# EAGLE schematic template_atmega328p (EAGLE 9.6.2)

## Sheet 1 of 2
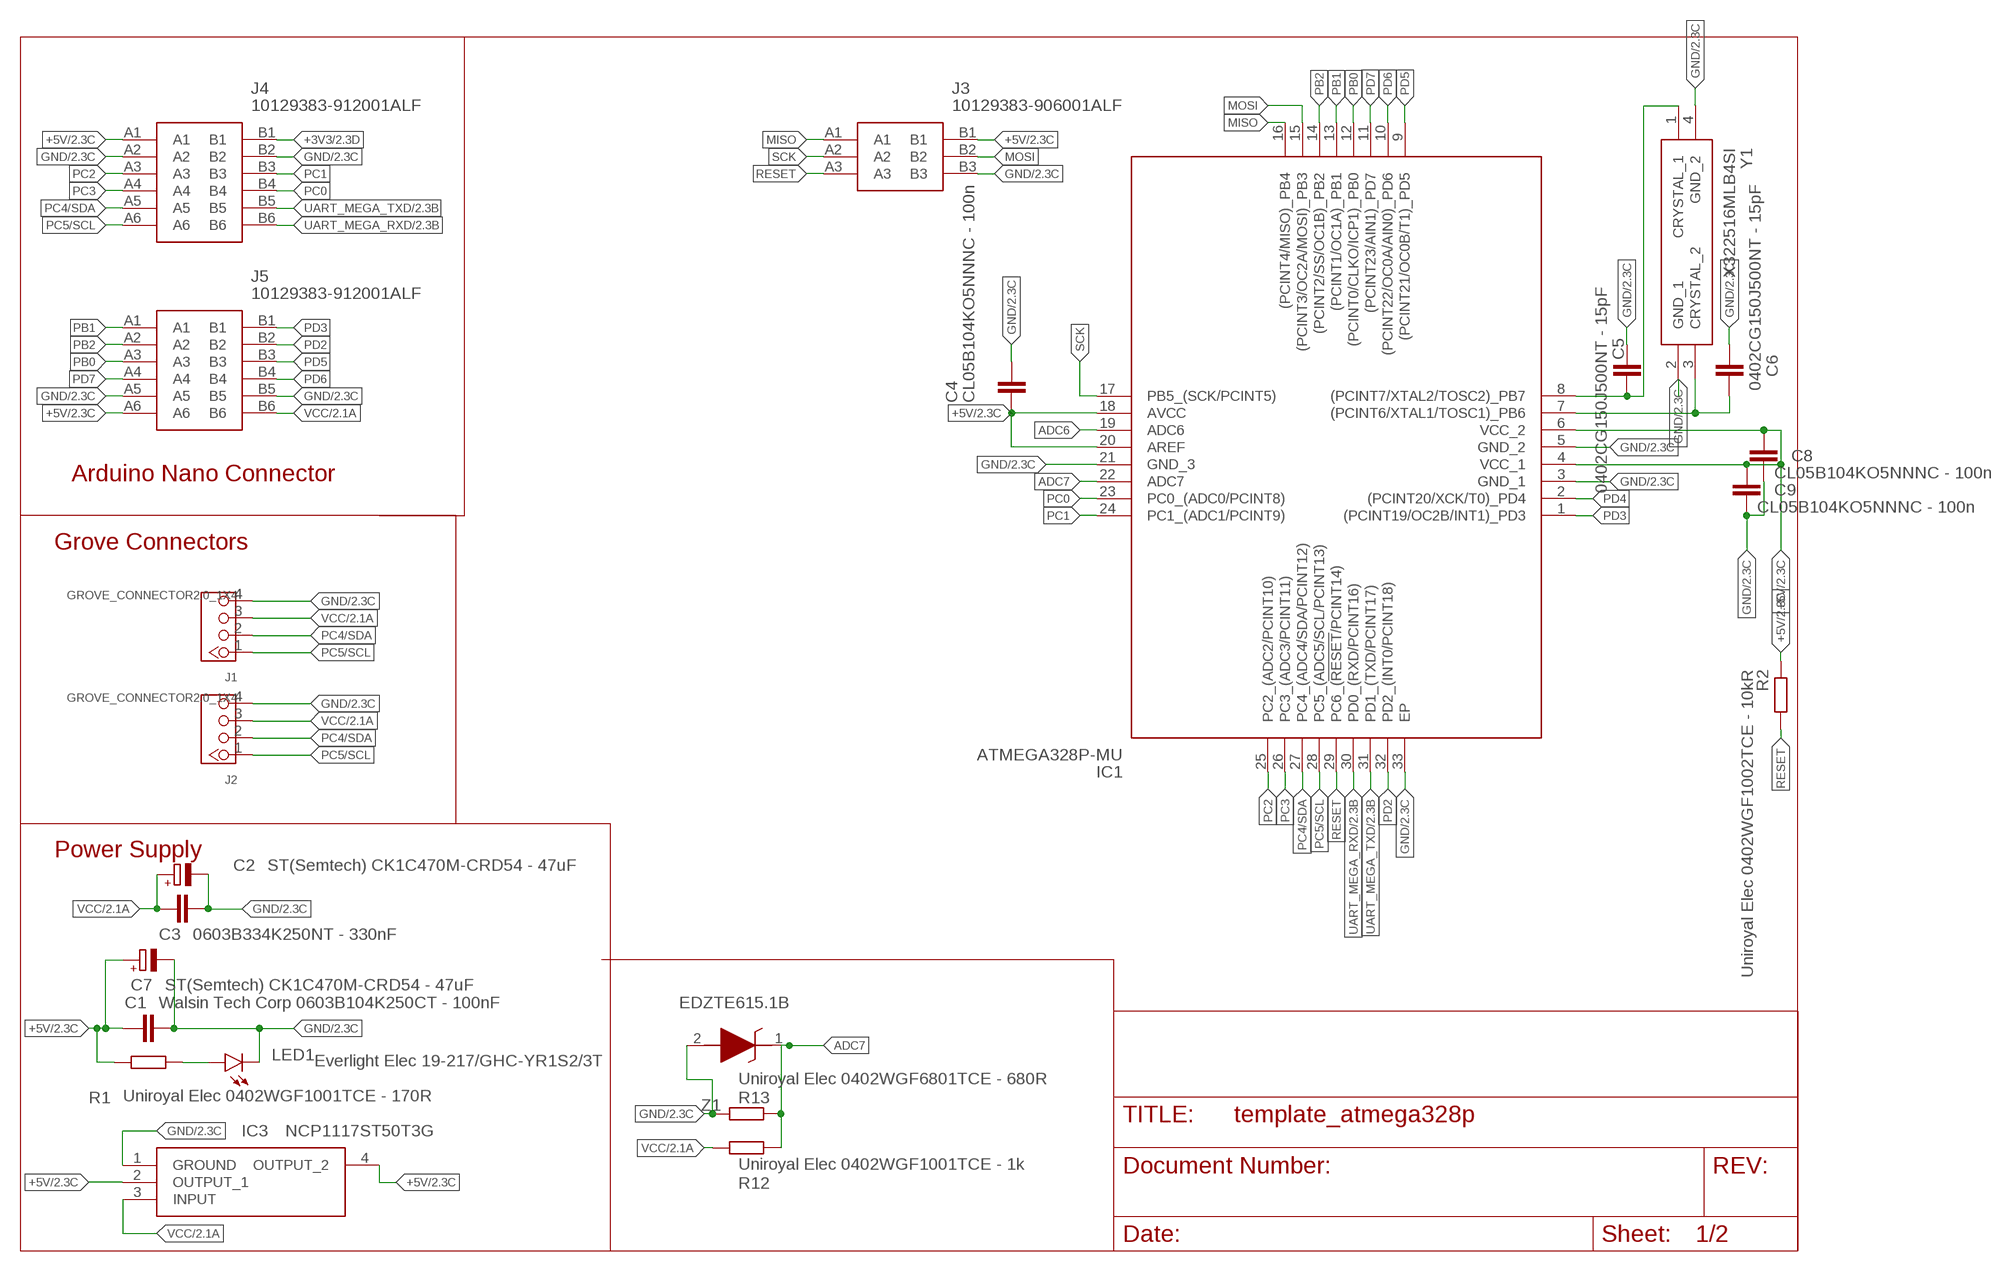
[diagram p0: schematic, sheet 1]

### Parts
C1  Walsin Tech Corp 0603B104K250CT - 100nF  C-EUC0603  [C0603]
C2  ST(Semtech) CK1C470M-CRD54 - 47uF  CPOL-EUC  [PANASONIC_C]
C3  0603B334K250NT - 330nF  C-EUC0603  [C0603]
C4  CL05B104KO5NNNC - 100n  C-EUC0402  [C0402]
C5  0402CG150J500NT - 15pF  C-EUC0402  [C0402]
C6  0402CG150J500NT - 15pF  C-EUC0402  [C0402]
C7  ST(Semtech) CK1C470M-CRD54 - 47uF  CPOL-EUC  [PANASONIC_C]
C8  CL05B104KO5NNNC - 100n  C-EUC0402  [C0402]
C9  CL05B104KO5NNNC - 100n  C-EUC0402  [C0402]
IC1  ATMEGA328P-MU  [QFN50P500X500X100-33N]
IC3  NCP1117ST50T3G  [SOT230P700X180-4N@1]
J1  GROVE_CONNECTOR2.0_1X4  [2.0_1X4_STRAIGHT]
J2  GROVE_CONNECTOR2.0_1X4  [2.0_1X4_STRAIGHT]
J3  10129383-906001ALF  [10129383906001ALF]
J4  10129383-912001ALF  [10129383912001ALF]
J5  10129383-912001ALF  [10129383912001ALF]
LED1  Everlight Elec 19-217/GHC-YR1S2/3T  LEDCHIPLED_0603  [CHIPLED_0603]
R1  Uniroyal Elec 0402WGF1001TCE - 170R  R-EU_R0402  [R0402]
R2  Uniroyal Elec 0402WGF1002TCE - 10kR  R-EU_R0402  [R0402]
R12  Uniroyal Elec 0402WGF1001TCE - 1k  R-EU_R0402  [R0402]
R13  Uniroyal Elec 0402WGF6801TCE - 680R  R-EU_R0402  [R0402]
Y1  X322516MLB4SI  [X322516MLB4SI]
Z1  EDZTE615.1B  [EMD2]

### Nets
+3V3: J4.B1 ; also sheet 2
+5V: C1.1 C4.1 C7.+ C8.2 C9.2 IC1.4(VCC_1) IC1.6(VCC_2) IC1.18(AVCC) IC1.20(AREF) IC3.2(OUTPUT_1) IC3.4(OUTPUT_2) J3.B1 J4.A1 J5.A6 R1.2 R2.2 ; also sheet 2
ADC6: IC1.19(ADC6)
ADC7: IC1.22(ADC7) R12.1 R13.2 Z1.1(K)
GND: C1.2 C2.- C3.1 C4.2 C5.1 C6.1 C7.- C8.1 C9.1 IC1.3(GND_1) IC1.5(GND_2) IC1.21(GND_3) IC1.33(EP) IC3.1(GROUND) J1.4 J2.4 J3.B3 J4.A2 J4.B2 J5.A5 J5.B5 LED1.C R13.1 Y1.2(GND_1) Y1.4(GND_2) Z1.2(A) ; also sheet 2
MISO: IC1.16((PCINT4/MISO)_PB4) J3.A1
MOSI: IC1.15((PCINT3/OC2A/MOSI)_PB3) J3.B2
N$1: LED1.A R1.1
N$2: C5.2 IC1.8((PCINT7/XTAL2/TOSC2)_PB7) Y1.1(CRYSTAL_1)
N$3: C6.2 IC1.7((PCINT6/XTAL1/TOSC1)_PB6) Y1.3(CRYSTAL_2)
PB0: IC1.12((PCINT0/CLKO/ICP1)_PB0) J5.A3
PB1: IC1.13((PCINT1/OC1A)_PB1) J5.A1
PB2: IC1.14((PCINT2/SS/OC1B)_PB2) J5.A2
PC0: IC1.23(PC0_(ADC0/PCINT8)) J4.B4
PC1: IC1.24(PC1_(ADC1/PCINT9)) J4.B3
PC2: IC1.25(PC2_(ADC2/PCINT10)) J4.A3
PC3: IC1.26(PC3_(ADC3/PCINT11)) J4.A4
PC4/SDA: IC1.27(PC4_(ADC4/SDA/PCINT12)) J1.2 J2.2 J4.A5
PC5/SCL: IC1.28(PC5_(ADC5/SCL/PCINT13)) J1.1 J2.1 J4.A6
PD2: IC1.32(PD2_(INT0/PCINT18)) J5.B2
PD3: IC1.1((PCINT19/OC2B/INT1)_PD3) J5.B1
PD4: IC1.2((PCINT20/XCK/T0)_PD4)
PD5: IC1.9((PCINT21/OC0B/T1)_PD5) J5.B3
PD6: IC1.10((PCINT22/OC0A/AIN0)_PD6) J5.B4
PD7: IC1.11((PCINT23/AIN1)_PD7) J5.A4
RESET: IC1.29(PC6_(!RESET!/PCINT14)) J3.A3 R2.1
SCK: IC1.17(PB5_(SCK/PCINT5)) J3.A2
UART_MEGA_RXD: IC1.30(PD0_(RXD/PCINT16)) J4.B6 ; also sheet 2
UART_MEGA_TXD: IC1.31(PD1_(TXD/PCINT17)) J4.B5 ; also sheet 2
VCC: C2.+ C3.2 IC3.3(INPUT) J1.3 J2.3 J5.B6 R12.2 ; also sheet 2

### Notes on the sheet
- Arduino Nano Connector
- Grove Connectors
- Power Supply

## Sheet 2 of 2
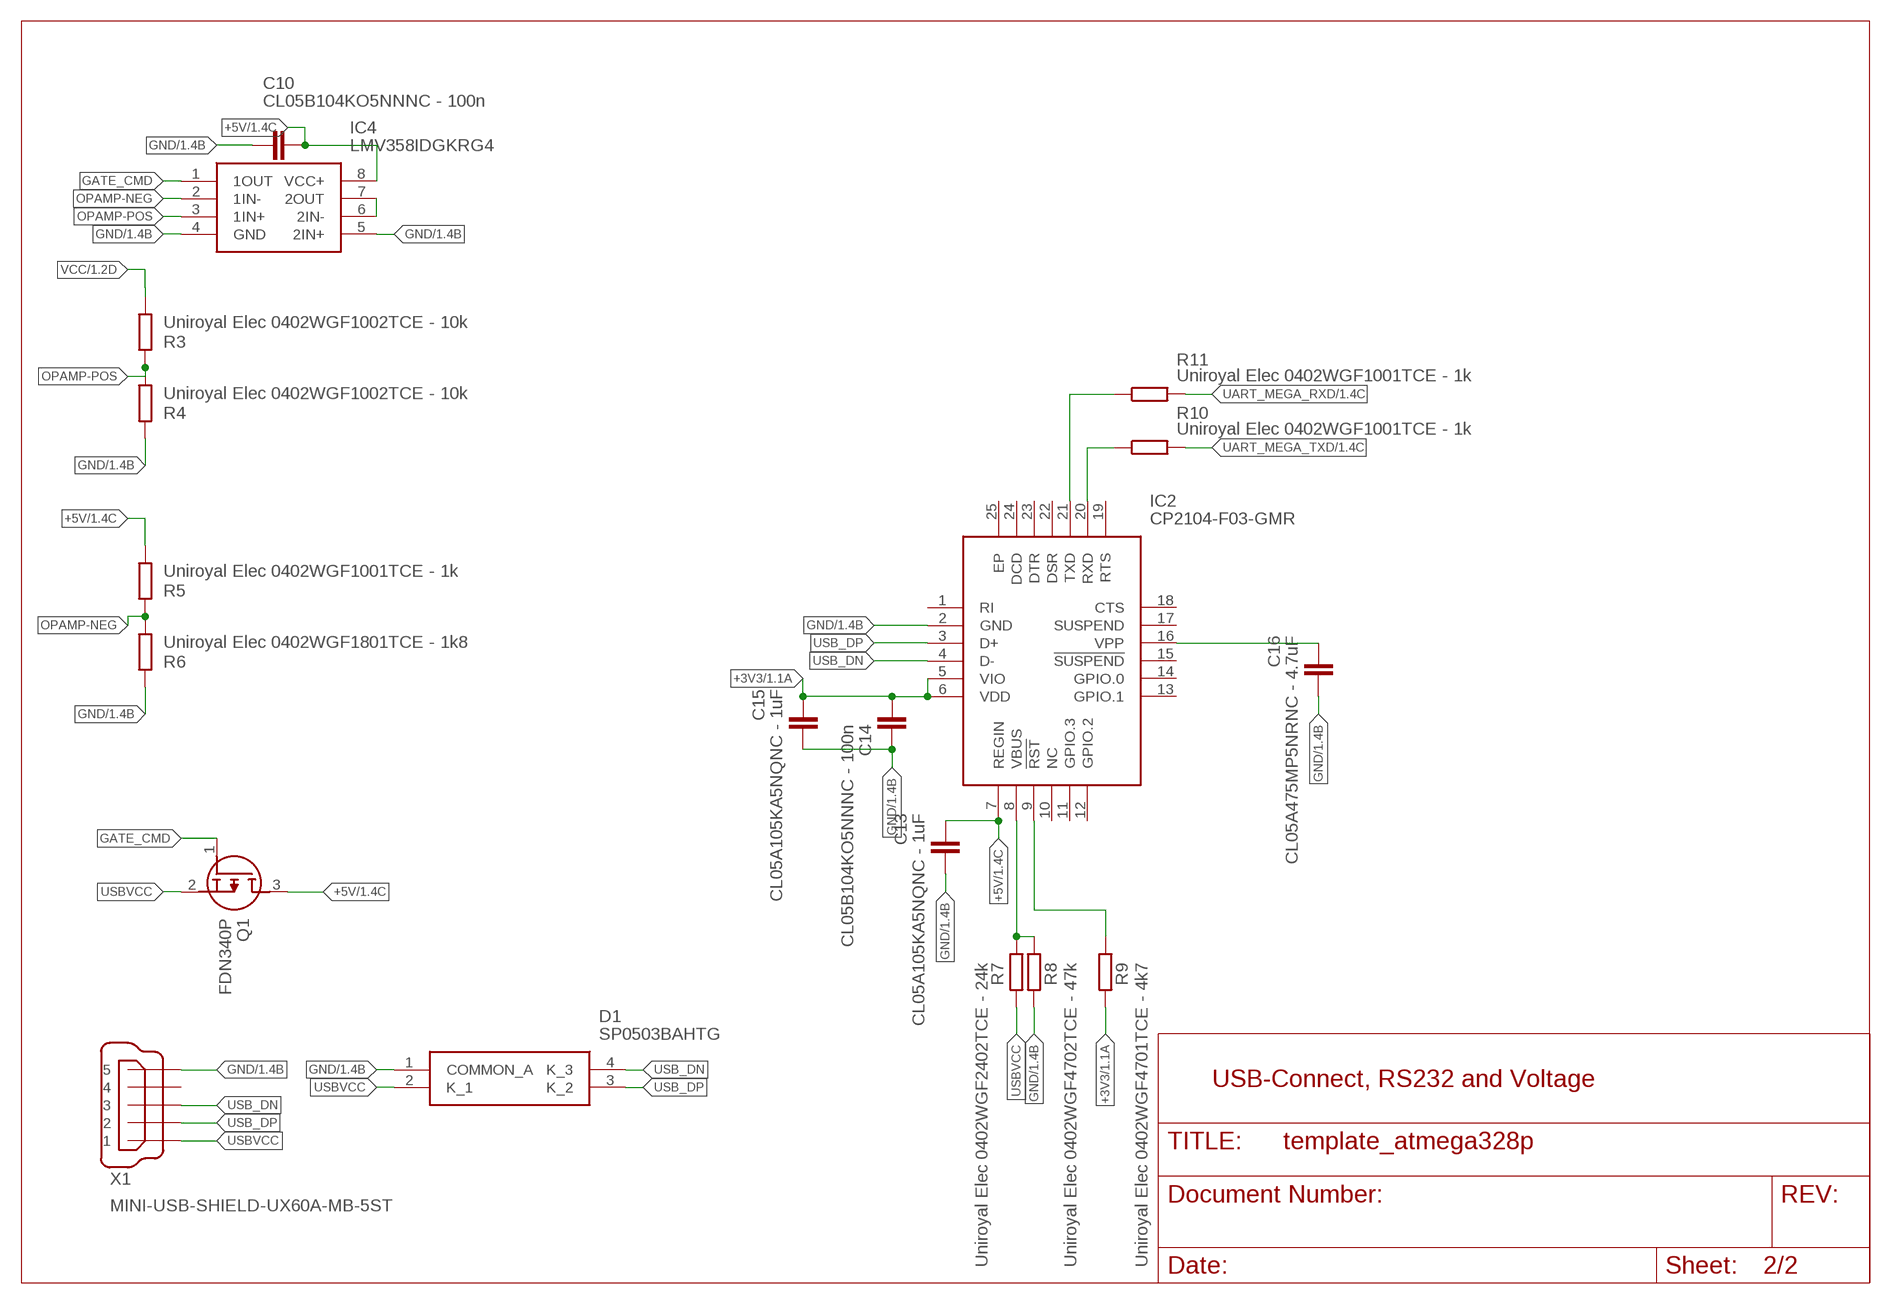
[diagram p1: schematic, sheet 2]

### Parts
C10  CL05B104KO5NNNC - 100n  C-EUC0402  [C0402]
C13  CL05A105KA5NQNC - 1uF  C-EUC0402  [C0402]
C14  CL05B104KO5NNNC - 100n  C-EUC0402  [C0402]
C15  CL05A105KA5NQNC - 1uF  C-EUC0402  [C0402]
C16  CL05A475MP5NRNC - 4.7uF  C-EUC0402  [C0402]
D1  SP0503BAHTG  [SP0503BAHTG]
IC2  CP2104-F03-GMR  [QFN50P400X400X80-25N]
IC4  LMV358IDGKRG4  [SOP65P490X110-8N]
Q1  FDN340P  [SOT95P237X112-3N]
R3  Uniroyal Elec 0402WGF1002TCE - 10k  R-EU_R0402  [R0402]
R4  Uniroyal Elec 0402WGF1002TCE - 10k  R-EU_R0402  [R0402]
R5  Uniroyal Elec 0402WGF1001TCE - 1k  R-EU_R0402  [R0402]
R6  Uniroyal Elec 0402WGF1801TCE - 1k8  R-EU_R0402  [R0402]
R7  Uniroyal Elec 0402WGF2402TCE - 24k  R-EU_R0402  [R0402]
R8  Uniroyal Elec 0402WGF4702TCE - 47k  R-EU_R0402  [R0402]
R9  Uniroyal Elec 0402WGF4701TCE - 4k7  R-EU_R0402  [R0402]
R10  Uniroyal Elec 0402WGF1001TCE - 1k  R-EU_R0402  [R0402]
R11  Uniroyal Elec 0402WGF1001TCE - 1k  R-EU_R0402  [R0402]
X1  MINI-USB-SHIELD-UX60A-MB-5ST  [UX60A-MB-5ST]

### Nets
+3V3: C14.2 C15.2 IC2.5(VIO) IC2.6(VDD) R9.2 ; also sheet 1
+5V: C10.2 C13.2 IC2.7(REGIN) IC4.8(VCC+) Q1.3(D) R5.1 ; also sheet 1
GATE_CMD: IC4.1(1OUT) Q1.1(G)
GND: C10.1 C13.1 C14.1 C15.1 C16.1 D1.1(COMMON_A) IC2.2(GND) IC4.4(GND) IC4.5(2IN+) R4.2 R6.2 R8.2 X1.5 ; also sheet 1
N$4: IC4.6(2IN-) IC4.7(2OUT)
N$5: IC2.8(VBUS) R7.1 R8.1
N$6: IC2.9(!RST) R9.1
N$7: C16.2 IC2.16(VPP)
N$8: IC2.21(TXD) R11.1
N$9: IC2.20(RXD) R10.1
OPAMP-NEG: IC4.2(1IN-) R5.2 R6.1
OPAMP-POS: IC4.3(1IN+) R3.2 R4.1
UART_MEGA_RXD: R11.2 ; also sheet 1
UART_MEGA_TXD: R10.2 ; also sheet 1
USB_DN: D1.4(K_3) IC2.4(D-) X1.3
USB_DP: D1.3(K_2) IC2.3(D+) X1.2
USBVCC: D1.2(K_1) Q1.2(S) R7.2 X1.1
VCC: R3.1 ; also sheet 1
Unconnected: IC2.1(RI) IC2.10(NC) IC2.11(GPIO.3) IC2.12(GPIO.2) IC2.13(GPIO.1) IC2.14(GPIO.0) IC2.15(!SUSPEND) IC2.17(SUSPEND) IC2.18(CTS) IC2.19(RTS) IC2.22(DSR) IC2.23(DTR) IC2.24(DCD) IC2.25(EP) X1.4 X1.M1(S1) X1.M2(S2) X1.M3(S3) X1.M4(S4)

### Notes on the sheet
- USB-Connect, RS232 and Voltage

## Library data of the parts
C1 C3-C6 C8-C10 C13-C16 = rcl:C-EU: CAPACITOR, European symbol; SPICEPREFIX: C
C2 C7 = rcl:CPOL-EU: POLARIZED CAPACITOR, European symbol; SPICEPREFIX: C
D1 = samacsys:SP0503BAHTG: ESD Suppressors / TVS Diodes TVS AVAL DIODE SMT Source: Datasheet <https://nl.mouser.com/datasheet/2/240/Littelfuse_TVS_Diode_Array_SP05_Datasheet.pdf-777043.pdf>; ARROW_PART_NUMBER: SP0503BAHTG; ARROW_PRICE-STOCK: https://www.arrow.com/en/products/sp0503bahtg/littelfuse; DESCRIPTION: ESD Suppressors / TVS Diodes TVS AVAL DIODE SMT; HEIGHT: 1.22mm; MANUFACTURER_NAME: LITTELFUSE; MANUFACTURER_PART_NUMBER: SP0503BAHTG; MOUSER_PART_NUMBER: 576-SP0503BAHTG; MOUSER_PRICE-STOCK: https://www.mouser.co.uk/ProductDetail/Littelfuse/SP0503BAHTG?qs=uD%2FdkN7XIa0NTYXwHdELYA%3D%3D
IC1 = samacsys:ATMEGA328P-MU: ATMEGA328P-MU, 8 bit AVR Microcontroller 20MHz 1, 32kb Flash, 2kb RAM, I2C SPI 32-Pin MLF Source: Datasheet <http://www.atmel.com/Images/Atmel-8271-8-bit-AVR-Microcontroller-ATmega48A-48PA-88A-88PA-168A-168PA-328-328P_datasheet.pdf>; ARROW_PART_NUMBER: ATMEGA328P-MU; ARROW_PRICE-STOCK: https://www.arrow.com/en/products/atmega328p-mu/microchip-technology; DESCRIPTION: ATMEGA328P-MU, 8 bit AVR Microcontroller 20MHz 1, 32kb Flash, 2kb RAM, I2C SPI 32-Pin MLF; HEIGHT: 1mm; MANUFACTURER_NAME: Microchip; MANUFACTURER_PART_NUMBER: ATMEGA328P-MU; MOUSER_PART_NUMBER: 556-ATMEGA328P-MU; MOUSER_PRICE-STOCK: https://www.mouser.co.uk/ProductDetail/Microchip-Technology-Atmel/ATMEGA328P-MU?qs=K8BHR703ZXgI55tOEPBx9w%3D%3D
IC2 = samacsys:CP2104-F03-GMR: USB-to-UART 1-CH 576byte FIFO 3.3V Automotive 24-Pin QFN EP T/R Source: Datasheet <https://www.silabs.com/documents/public/data-sheets/cp2104.pdf>; ARROW_PART_NUMBER: CP2104-F03-GMR; ARROW_PRICE-STOCK: https://www.arrow.com/en/products/cp2104-f03-gmr/silicon-labs; DESCRIPTION: USB-to-UART 1-CH 576byte FIFO 3.3V Automotive 24-Pin QFN EP T/R; HEIGHT: 0.8mm; MANUFACTURER_NAME: Silicon Labs; MANUFACTURER_PART_NUMBER: CP2104-F03-GMR; MOUSER_PART_NUMBER: 634-CP2104-F03-GMR; MOUSER_PRICE-STOCK: https://www.mouser.co.uk/ProductDetail/Silicon-Labs/CP2104-F03-GMR?qs=1CB38rTTsYrRJKVkczeRzA%3D%3D
IC3 = samacsys:NCP1117ST50T3G: ON SEMICONDUCTOR - NCP1117ST50T3G - LDO, REG, 20VIN, 1A, 5V, 1%, SOT223-3 Source: Datasheet <http://www.onsemi.com/pub/Collateral/NCP1117-D.PDF>; ARROW_PART_NUMBER: NCP1117ST50T3G; ARROW_PRICE-STOCK: https://www.arrow.com/en/products/ncp1117st50t3g/on-semiconductor; DESCRIPTION: ON SEMICONDUCTOR - NCP1117ST50T3G - LDO, REG, 20VIN, 1A, 5V, 1%, SOT223-3; HEIGHT: 1.8mm; MANUFACTURER_NAME: ON Semiconductor; MANUFACTURER_PART_NUMBER: NCP1117ST50T3G; MOUSER_PART_NUMBER: 863-NCP1117ST50T3G; MOUSER_PRICE-STOCK: https://www.mouser.co.uk/ProductDetail/ON-Semiconductor/NCP1117ST50T3G?qs=Gev%252BmEvV0ib6dijy6U0dhQ%3D%3D
IC4 = samacsys:LMV358IDGKRG4: Operational Amplifiers - Op Amps Dual Low-Voltage Rail-to-Rail Out Source: Datasheet <http://www.ti.com/lit/ds/symlink/lmv358.pdf>; ARROW_PART_NUMBER: LMV358IDGKRG4; ARROW_PRICE-STOCK: https://www.arrow.com/en/products/lmv358idgkrg4/texas-instruments; DESCRIPTION: Operational Amplifiers - Op Amps Dual Low-Voltage Rail-to-Rail Out; HEIGHT: 1.1mm; MANUFACTURER_NAME: Texas Instruments; MANUFACTURER_PART_NUMBER: LMV358IDGKRG4; MOUSER_PART_NUMBER: 595-LMV358IDGKRG4; MOUSER_PRICE-STOCK: https://www.mouser.co.uk/ProductDetail/Texas-Instruments/LMV358IDGKRG4?qs=paYhMW8qfiuzqo4cLPZoVQ%3D%3D
J1 J2 = morphbot:GROVE_CONNECTOR: Seeedstudio Grove-Connector: 1 = SCL 2 = SDA 3 = VCC 4 = GND
J3 = samacsys:10129383-906001ALF: Headers & Wire Housings ECONOSTIK HEADER DR VT SMT 2X3 Source: Datasheet <https://componentsearchengine.com/Datasheets/1/10129383-906001ALF.pdf>; ARROW_PART_NUMBER: 10129383-906001ALF; ARROW_PRICE-STOCK: https://www.arrow.com/en/products/10129383-906001alf/amphenol-fci; DESCRIPTION: Headers & Wire Housings ECONOSTIK HEADER DR VT SMT 2X3; HEIGHT: 8.58mm; MANUFACTURER_NAME: Amphenol; MANUFACTURER_PART_NUMBER: 10129383-906001ALF; MOUSER_PART_NUMBER: 649-1012938390601ALF; MOUSER_PRICE-STOCK: https://www.mouser.co.uk/ProductDetail/Amphenol-FCI/10129383-906001ALF?qs=0lQeLiL1qyZsINMRDvT9Pw%3D%3D
J4 J5 = samacsys:10129383-912001ALF: EconoStik, Board to Board connector, Unshrouded Vertical Header, Surface Mount, Double Row, Positions, 2.54 mm (0.100in) Pitch. Source: Datasheet <https://componentsearchengine.com/Datasheets/1/10129383-912001ALF.pdf>; DESCRIPTION: EconoStik, Board to Board connector, Unshrouded Vertical Header, Surface Mount, Double Row, Positions, 2.54 mm (0.100in) Pitch.; HEIGHT: 8.58mm; MANUFACTURER_NAME: Amphenol; MANUFACTURER_PART_NUMBER: 10129383-912001ALF; MOUSER_PART_NUMBER: 649-1012938391201ALF; MOUSER_PRICE-STOCK: https://www.mouser.co.uk/ProductDetail/Amphenol-FCI/10129383-912001ALF?qs=0lQeLiL1qyZD4F7peRNLhQ%3D%3D
LED1 = led:LED: LED OSRAM: - CHIPLED LG R971, LG N971, LY N971, LG Q971, LY Q971, LO R971, LY R971 LH N974, LH R974 LS Q976, LO Q976, LY Q976 LO Q996 - Hyper CHIPLED LW Q18S LB Q993, LB Q99A, LB R99A - SideLED LS A670, LO A670, LY A670, LG A670, LP A670 LB A673, LV A673, LT A673, LW A673 LH A674 LY A675 LS A676, LA A676, LO A676, LY A676, LW A676 LS A679, LY A679, LG A679 - Hyper Micro SIDELED® LS Y876, LA Y876, LO Y876, LY Y876 LT Y87S - SmartLED LW L88C, LW L88S LB L89C, LB L89S, LG L890 LS L89K, LO L89K, LY L89K LS L896, LA L896, LO L896, LY L896 - TOPLED LS T670, LO T670, LY T670, LG T670, LP T670 LSG T670, LSP T670, LSY T670, LOP T670, LYG T670 LG T671, LOG T671, LSG T671 LB T673, LV T673, LT T673, LW T673 LH T674 LS T676, LA T676, LO T676, LY T676, LB T676, LH T676, LSB T676, LW T676 LB T67C, LV T67C, LT T67C, LS T67K, LO T67K, LY T67K, LW E67C LS E67B, LA E67B, LO E67B, LY E67B, LB E67C, LV E67C, LT E67C LW T67C LS T679, LY T679, LG T679 LS T770, LO T770, LY T770, LG T770, LP T770 LB T773, LV T773, LT T773, LW T773 LH T774 LS E675, LA E675, LY E675, LS T675 LS T776, LA T776, LO T776, LY T776, LB T776 LHGB T686 LT T68C, LB T68C - Hyper Mini TOPLED® LB M676 - Mini TOPLED Santana® LG M470 LS M47K, LO M47K, LY M47K Source: http://www.osram.convergy.de LUXEON: - LUMILED® LXK2-PW12-R00, LXK2-PW12-S00, LXK2-PW14-U00, LXK2-PW14-V00 LXK2-PM12-R00, LXK2-PM12-S00, LXK2-PM14-U00 LXK2-PE12-Q00, LXK2-PE12-R00, LXK2-PE12-S00, LXK2-PE14-T00, LXK2-PE14-U00 LXK2-PB12-K00, LXK2-PB12-L00, LXK2-PB12-M00, LXK2-PB14-N00, LXK2-PB14-P00, LXK2-PB14-Q00 LXK2-PR12-L00, LXK2-PR12-M00, LXK2-PR14-Q00, LXK2-PR14-R00 LXK2-PD12-Q00, LXK2-PD12-R00, LXK2-PD12-S00 LXK2-PH12-R00, LXK2-PH12-S00 LXK2-PL12-P00, LXK2-PL12-Q00, LXK2-PL12-R00 Source: www.luxeon.com KINGBRIGHT: KA-3528ASYC Source: www.kingbright.com
Q1 = samacsys:FDN340P: Trans MOSFET P-CH 20V 2A 3-Pin SuperSOT Source: Datasheet <https://www.onsemi.com/pub/Collateral/FDN340P-D.PDF>; ARROW_PART_NUMBER: FDN340P; ARROW_PRICE-STOCK: https://www.arrow.com/en/products/fdn340p/on-semiconductor; DESCRIPTION: Trans MOSFET P-CH 20V 2A 3-Pin SuperSOT; HEIGHT: 1.12mm; MANUFACTURER_NAME: ON Semiconductor; MANUFACTURER_PART_NUMBER: FDN340P; MOUSER_PART_NUMBER: 512-FDN340P; MOUSER_PRICE-STOCK: https://www.mouser.co.uk/ProductDetail/ON-Semiconductor-Fairchild/FDN340P?qs=AMp2PTjoga9dhzFXRaqTZw%3D%3D
R1-R13 = rcl:R-EU_: RESISTOR, European symbol; SPICEPREFIX: R
X1 = con-hirose:MINI-USB-SHIELD-: MINI USB Connector Source: http://www.hirose.co.jp/cataloge_hp/e24000019.pdf; OC_FARNELL: unknown; OC_NEWARK: unknown
Y1 = samacsys:X322516MLB4SI: Crystal Source: Datasheet <https://datasheet.lcsc.com/szlcsc/Yangxing-Tech-X322516MLB4SI_C13738.pdf>; DESCRIPTION: Crystal; HEIGHT: 0.8mm; MANUFACTURER_NAME: Yangxing Tech; MANUFACTURER_PART_NUMBER: X322516MLB4SI
Z1 = samacsys:EDZTE615.1B: ROHM EDZTE615.1B Zener Diode, 5.1V 2% 0.1 W SMT 2-Pin EMD Source: Datasheet <https://www.rohm.com/datasheet/EDZ5.1B>; DESCRIPTION: ROHM EDZTE615.1B Zener Diode, 5.1V 2% 0.1 W SMT 2-Pin EMD; HEIGHT: mm; MANUFACTURER_NAME: ROHM Semiconductor; MANUFACTURER_PART_NUMBER: EDZTE615.1B; MOUSER_PART_NUMBER: 755-EDZTE615.1B; MOUSER_PRICE-STOCK: https://www.mouser.co.uk/ProductDetail/ROHM-Semiconductor/EDZTE6151B?qs=4kLU8WoGk0uAJO8EOvJm8g%3D%3D